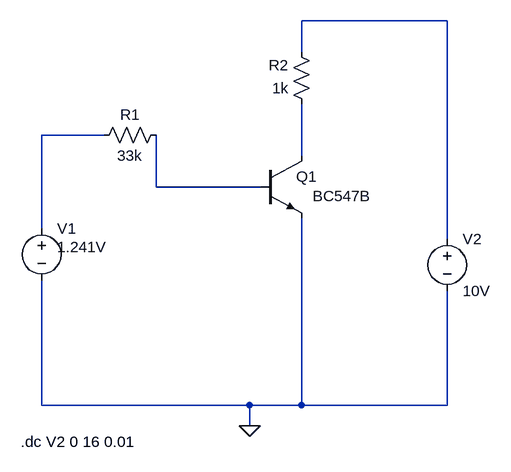
[diagram p0: schematic Lab2.asc]
Lab2.asc, the LTspice schematic file:
Version 4
SHEET 1 1432 680
WIRE 512 -112 288 -112
WIRE 288 -64 288 -112
WIRE -16 64 -112 64
WIRE 288 96 288 16
WIRE 64 144 64 64
WIRE 224 144 64 144
WIRE -112 208 -112 64
WIRE 512 224 512 -112
WIRE -112 480 -112 288
WIRE 208 480 -112 480
WIRE 288 480 288 192
WIRE 288 480 208 480
WIRE 512 480 512 304
WIRE 512 480 288 480
WIRE 208 512 208 480
FLAG 208 512 0
SYMBOL res 80 48 R90
WINDOW 0 0 56 VBottom 2
WINDOW 3 32 56 VTop 2
SYMATTR InstName R1
SYMATTR Value 33k
SYMBOL res 304 32 R180
WINDOW 0 36 76 Left 2
WINDOW 3 36 40 Left 2
SYMATTR InstName R2
SYMATTR Value 1k
SYMBOL voltage -112 192 R0
WINDOW 123 0 0 Left 0
WINDOW 39 0 0 Left 0
WINDOW 3 24 44 Left 2
SYMATTR InstName V1
SYMATTR Value 1.241V
SYMBOL voltage 512 208 R0
WINDOW 123 0 0 Left 0
WINDOW 39 0 0 Left 0
SYMATTR InstName V2
SYMATTR Value 10V
SYMBOL npn 224 96 R0
WINDOW 3 81 62 Left 2
SYMATTR Value BC547B
SYMATTR InstName Q1
TEXT -144 536 Left 2 !.dc V2 0 16 0.01

The netlist it stands for:
* Lab2.asc
R1 N004 N002 33k
R2 N003 N001 1k
V1 N002 0 1.241V
V2 N001 0 10V
Q1 N003 N004 0 0 BC547B
.model NPN NPN
.model PNP PNP
.lib standard.bjt
.dc V2 0 16 0.01
.backanno
.end